# Altium project Leaf.PrjPcb
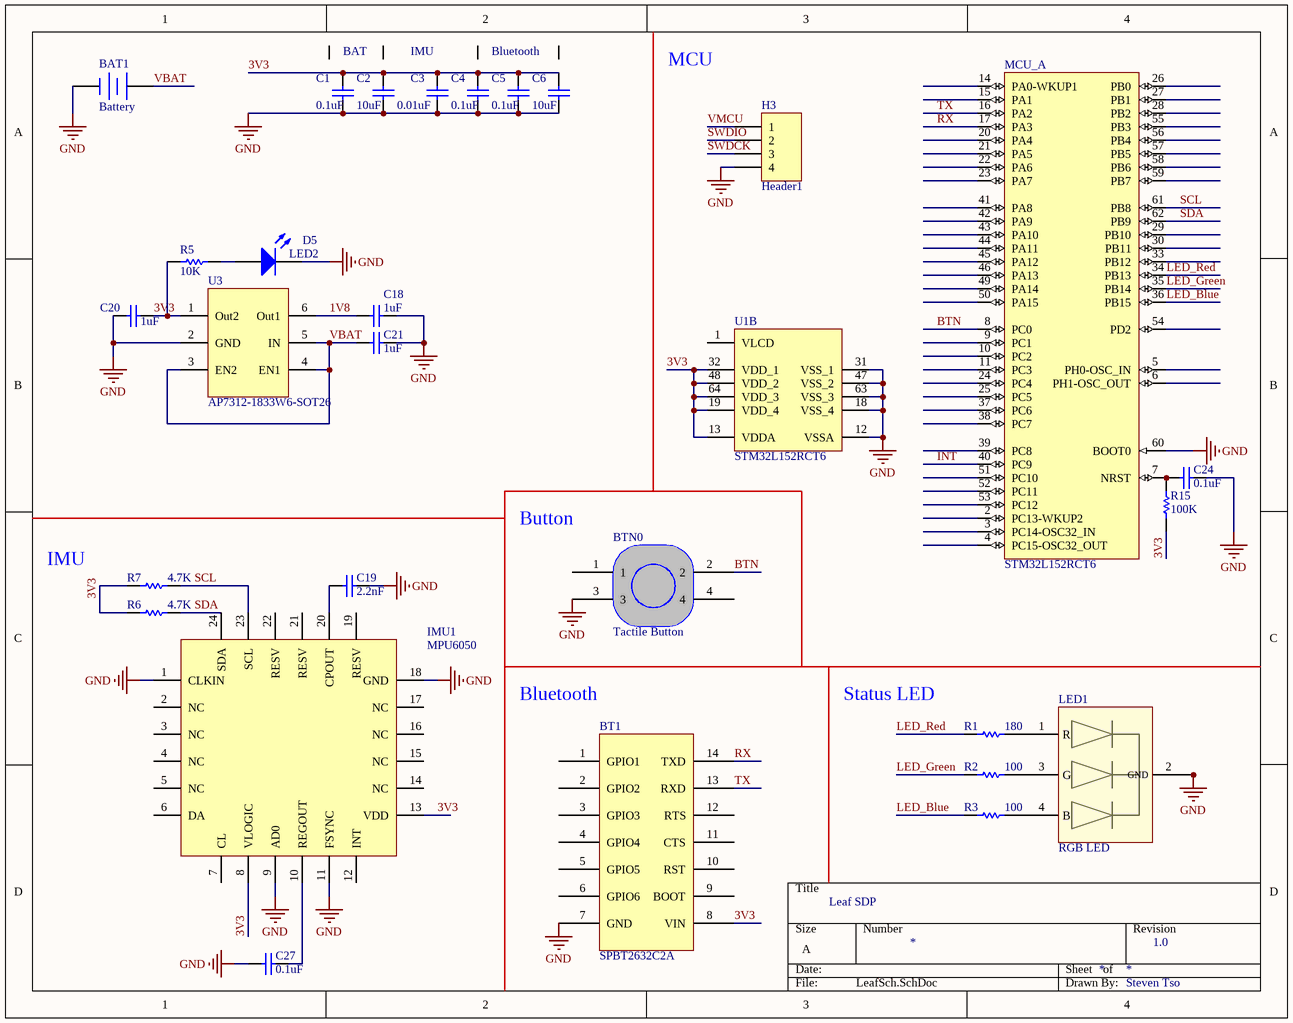
[diagram p0: LeafSch.SchDoc]
1 sheet, 29 parts. Net scope: global (net labels, ports and power ports of the same name join across sheets).

## Sheet LeafSch.SchDoc
size A; DrawnBy: Steven Tso; Organization: Leaf; DocumentName: Leaf SDP

### Parts
BAT1  Battery  [BAT-2]
BT1  SPBT2632C2A  [SPBT2632C2A]
BTN0  Tactile Button
C1  0.1uF  [CAPC0805(2012)100_N]
C2  10uF  [CAPC0805(2012)100_N]
C3  0.01uF  [CAPC0805(2012)100_N]
C4  0.1uF  [CAPC0805(2012)100_N]
C5  0.1uF  [CAPC0805(2012)100_N]
C6  10uF  [CAPC0805(2012)100_N]
C18  1uF  [CAPC0603(1608)100_M]
C19  2.2nF  [CAPC0603(1608)100_M]
C20  1uF  [CAPC0603(1608)100_M]
C21  1uF  [CAPC0603(1608)100_M]
C24  0.1uF  [CAPC0603(1608)100_M]
C27  0.1uF  [CAPC0603(1608)100_M]
D5  LED2  [3.2X1.6X1.1]
H3  Header1  [HDR1X4]
IMU1  MPU6050
LED1  RGB LED
MCU_  STM32L152RCT6  [STM-LQFP64_N]  (part A of 2)
R1  180  [RESC0603(1608)_L]
R2  100  [RESC0603(1608)_L]
R3  100  [RESC0603(1608)_L]
R5  10K  [RESC0603(1608)_L]
R6  4.7K  [RESC0603(1608)_L]
R7  4.7K  [RESC0603(1608)_L]
R15  100K  [RESC0603(1608)_L]
U1  STM32L152RCT6  [STM-LQFP64_N]  (part B of 2)
U3  AP7312-1833W6-SOT26  [SOT26A-6AN]

### Nets
GND: BAT1.2(-) BT1.7(GND) BTN0.3 C1.2 C2.2 C3.2 C4.2 C5.2 C6.2 C18.1 C19.1 C20.2 C21.1 C24.1 C27.2 D5.2(K) H3.4 IMU1.1(CLKIN) IMU1.9(AD0) IMU1.11(FSYNC) IMU1.18(GND) LED1.2(GND) MCU_.60(BOOT0) U1.12(VSSA) U1.18(VSS_4) U1.31(VSS_1) U1.47(VSS_2) U1.63(VSS_3) U3.2(GND)
1V8: C18.2 U3.6(Out1)
3V3: BT1.8(VIN) C1.1 C2.1 C3.1 C4.1 C5.1 C6.1 C20.1 IMU1.8(VLOGIC) IMU1.13(VDD) R5.2 R6.1 R7.1 R15.1 U1.13(VDDA) U1.19(VDD_4) U1.32(VDD_1) U1.48(VDD_2) U1.64(VDD_3) U3.1(Out2)
BTN: BTN0.2 MCU_.8(PC0)
INT: MCU_.40(PC9)
LED_Blue: MCU_.36(PB15) R3.2
LED_Green: MCU_.35(PB14) R2.2
LED_Red: MCU_.34(PB13) R1.2
RX: BT1.14(TXD) MCU_.17(PA3)
SCL: IMU1.23(SCL) MCU_.61(PB8) R7.2
SDA: IMU1.24(SDA) MCU_.62(PB9) R6.2
SWDCK: H3.3
SWDIO: H3.2
TX: BT1.13(RXD) MCU_.16(PA2)
VBAT: BAT1.1(+) C21.2 U3.3(EN2) U3.4(EN1) U3.5(IN)
VMCU: H3.1
NetC19_2: C19.2 IMU1.20(CPOUT)
NetC24_2: C24.2 MCU_.7(NRST) R15.2
NetC27_1: C27.1 IMU1.10(REGOUT)
NetD5_1: D5.1(A) R5.1
NetLED1_1: LED1.1(R) R1.1
NetLED1_3: LED1.3(G) R2.1
NetLED1_4: LED1.4(B) R3.1

Not connected (* = marked no-connect by the designer): BT1 1(GPIO1) 2(GPIO2) 3(GPIO3) 4(GPIO4) 5(GPIO5) 6(GPIO6) 9(BOOT) 10(RST) 11(CTS) 12(RTS); BTN0 1 4; IMU1 2(NC) 3(NC) 4(NC) 5(NC) 6(DA) 7(CL) 12(INT) 14(NC) 15(NC) 16(NC) 17(NC) 19(RESV) 21(RESV) 22(RESV); MCU_ 2(PC13-WKUP2) 3(PC14-OSC32_IN) 4(PC15-OSC32_OUT) 5(PH0-OSC_IN) 6(PH1-OSC_OUT) 9(PC1) 10(PC2) 11(PC3) 14(PA0-WKUP1) 15(PA1) 20(PA4) 21(PA5) 22(PA6) 23(PA7) 24(PC4) 25(PC5) 26(PB0) 27(PB1) 28(PB2) 29(PB10) 30(PB11) 33(PB12) 37(PC6) 38(PC7) 39(PC8) 41(PA8) 42(PA9) 43(PA10) 44(PA11) 45(PA12) 46(PA13) 49(PA14) 50(PA15) 51(PC10) 52(PC11) 53(PC12) 54(PD2) 55(PB3) 56(PB4) 57(PB5) 58(PB6) 59(PB7); U1 1(VLCD)

### Notes on the sheet
- BAT
- IMU
- Bluetooth
- MCU
- (near BTN0) Button
- (near R1) Status LED
- Leaf SDP
- *
- 1.0
- Steven Tso

### Library data of the parts
BAT1 = Battery: Multicell Battery; Published: 24-Mar-1999; LatestRevisionDate: 17-Jul-2002; LatestRevisionNote: Re-released for DXP Platform.; PackageReference: BAT-2; Publisher: Altium Limited; PackageDescription: Battery; 2 Leads
C1-C6 = CMP-1036-04751-1: CAP 1uF 16V -20% to +80% 0805 (2012 Metric) Thickness 1mm SMD; Case-Metric: 2012; Case-EIA: 0805; Max Thickness: 1 mm; Rated Voltage: 16 V; Value: 1uF; Tolerance: -20% to +80%; Technology: SMT
C18-C21 C24 C27 = CMP-1035-02739-1: CAP 1uF 16V -20% to +80% 0603 (1608 Metric) Thickness 1mm SMD; Case-EIA: 0603; Case-Metric: 1608; Tolerance: -20% to +80%; Value: 1uF; Rated Voltage: 16 V; Technology: SMT; Max Thickness: 1 mm
D5 = LED2: Typical RED, GREEN, YELLOW, AMBER GaAs LED; Published: 8-Jun-2000; LatestRevisionDate: 17-Jul-2002; LatestRevisionNote: Re-released for DXP Platform.; PackageVersion: Feb-2002; PackageReference: 3.2X1.6X1.1; Publisher: Altium Limited; PackageDescription: SM LED; 2 Flat Leads
H3 = Header 4: Header, 4-Pin; LatestRevisionDate: 17-Jul-2002; LatestRevisionNote: Re-released for DXP Platform.; Publisher: Altium Limited
MCU_ U1 = STM32L152RCT6: ARM Cortex-M3 32-bit MCU, 256 KB Flash, 32 KB Internal RAM, 51 I/Os, 64-pin LQFP, -40 to 85 degC, Tray; D/A Converter: 2x12-bit (2 Channel); Data E2PROM nom (B): 8192; Display controller: LCD 4x32/8x28; FLASH Size (Prog) (kB): 256; I/Os (High Current): 51; Internal RAM Size (kB): 32; Supply Voltage(Vcc) min (V): 1.65; DatasheetVersion: Rev. 3; PackageVersion: Rev. 4, 06/2013; PackageReference: LQFP64; PackageDescription: 64-Pin Low Profile Quad Flat Package, 10 x 10 mm Body, 0.5 mm Pitch; Supplier 1: Digi-Key; Supplier Part Number 1: STM32L152RCT6-ND; Supplier 2: Farnell; Supplier Part Number 2: 2333394; Supplier 3: Newark; Supplier Part Number 3: 99W9965; Supplier 4: Newark; Supplier Part Number 4: 89W1501; Supplier 5: Mouser; Supplier Part Number 5: 511-STM32L152RCT6; Core: ARM Cortex-M3; Operating Frequency(F) (Processor speed) (MHz): 32; Packing: Tray; Mounting Technology: Surface Mount; PartNumber: STM32L152RCT6; ComponentLink1Description: Manufacturer URL; ComponentLink1URL: http://www.st.com/web/en/home.html; ComponentLink2Description: Datasheet; ComponentLink2URL: http://www.st.com/st-web-ui/static/active/en/resource/technical/document/datasheet/DM00048356.pdf; ComponentLink3Description: Package Specification; ComponentLink3URL: http://www.st.com/st-web-ui/static/active/en/resource/technical/document/datasheet/DM00037051.pdf
R1 = CMP-1012-00074-1: 10K 0.1W 5% 0603 (1608 Metric)  SMD; Case-EIA: 0603; Case-Metric: 1608; Value: 180.00 Ohm; Technology: SMT; Tolerance: 5 %; Power: 0.1 W
R2 R3 R5-R7 R15 = CMP-1012-00074-1: 10K 0.1W 5% 0603 (1608 Metric)  SMD; Case-EIA: 0603; Case-Metric: 1608; Value: 1000.00 Ohm; Technology: SMT; Tolerance: 5 %; Power: 0.1 W